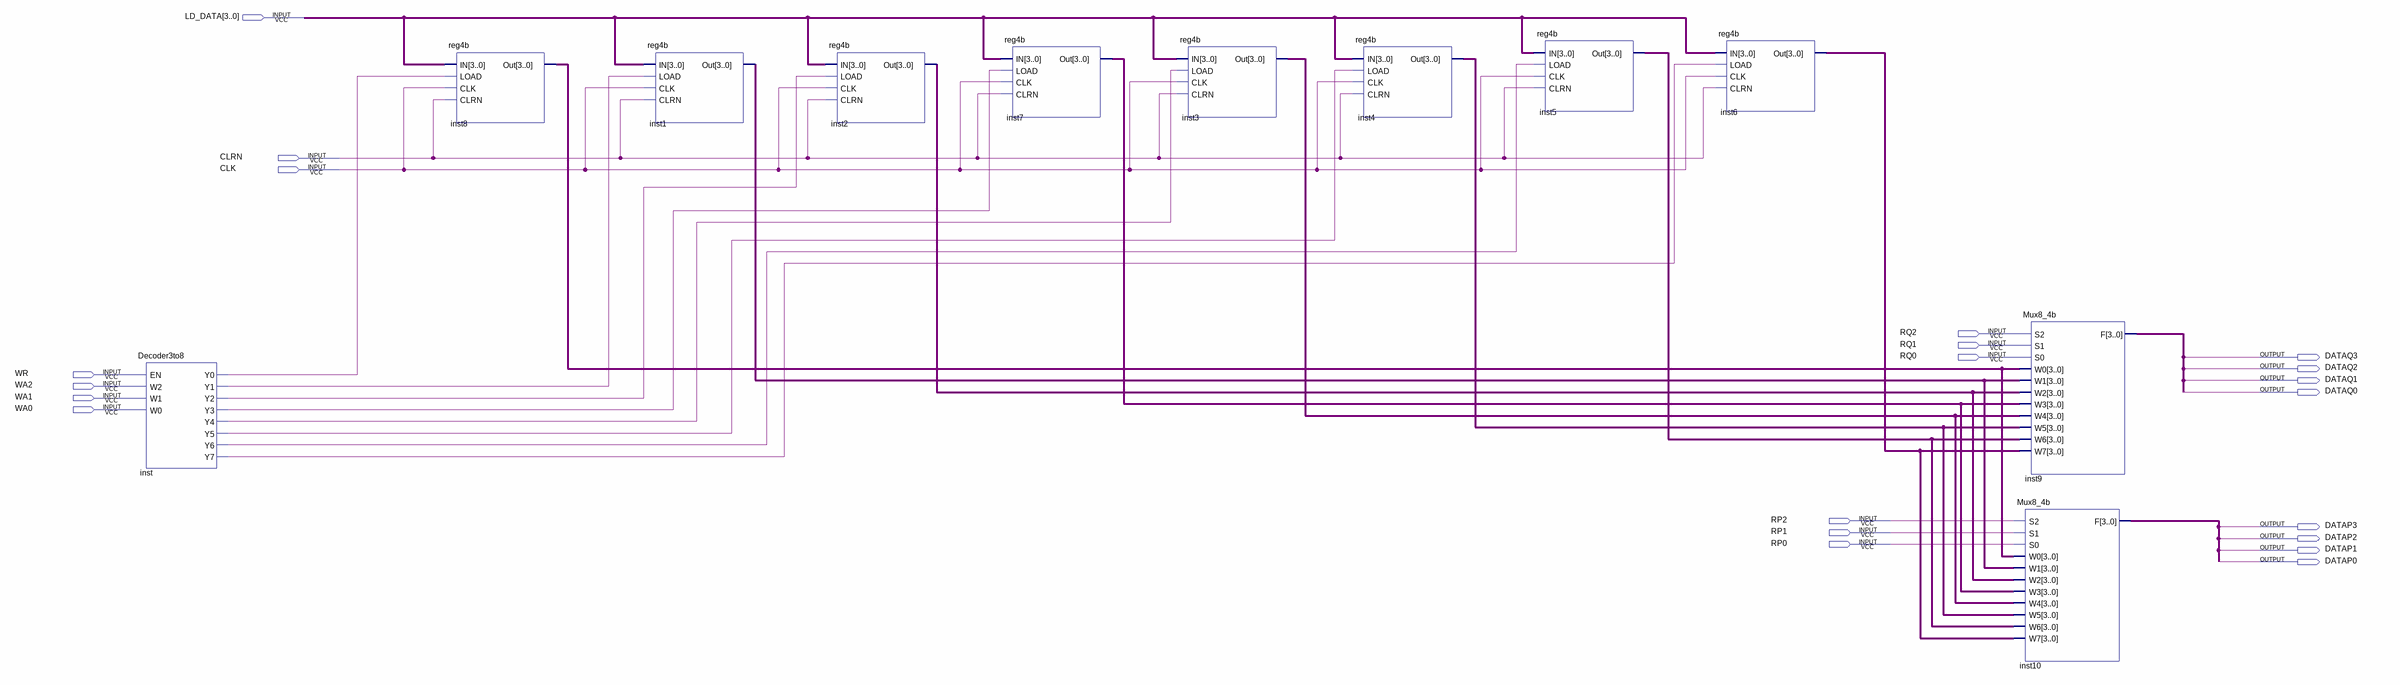
[diagram p0: schematic sheet]
// Quartus schematic regfile.bdf as structural Verilog: 11 symbols, 21 pins
module regfile (
  input  [3:0] LD_DATA,
  input  CLRN,
  input  CLK,
  input  RQ2,
  input  RQ1,
  input  RQ0,
  input  WR,
  input  WA2,
  input  WA1,
  input  WA0,
  input  RP2,
  input  RP1,
  input  RP0,
  output DATAQ3,
  output DATAQ2,
  output DATAQ1,
  output DATAQ0,
  output DATAP3,
  output DATAP2,
  output DATAP1,
  output DATAP0
);

  wire inst_y0, inst_y1, inst_y2, inst_y3, inst_y4, inst_y5, inst_y6, inst_y7;
  wire [3:0] inst1_out, inst2_out, inst3_out, inst4_out, inst5_out, inst6_out, inst7_out, inst8_out, inst9_f,
       inst10_f;

  Decoder3to8 inst (
    .EN(WR), .W2(WA2), .W1(WA1), .W0(WA0), .Y0(inst_y0), .Y1(inst_y1), .Y2(inst_y2), .Y3(inst_y3),
    .Y4(inst_y4), .Y5(inst_y5), .Y6(inst_y6), .Y7(inst_y7));
  reg4b inst8 (.IN(LD_DATA), .LOAD(inst_y0), .CLK(CLK), .CLRN(CLRN), .Out(inst8_out));
  reg4b inst1 (.IN(LD_DATA), .LOAD(inst_y1), .CLK(CLK), .CLRN(CLRN), .Out(inst1_out));
  reg4b inst2 (.IN(LD_DATA), .LOAD(inst_y2), .CLK(CLK), .CLRN(CLRN), .Out(inst2_out));
  reg4b inst7 (.IN(LD_DATA), .LOAD(inst_y3), .CLK(CLK), .CLRN(CLRN), .Out(inst7_out));
  reg4b inst3 (.IN(LD_DATA), .LOAD(inst_y4), .CLK(CLK), .CLRN(CLRN), .Out(inst3_out));
  reg4b inst4 (.IN(LD_DATA), .LOAD(inst_y5), .CLK(CLK), .CLRN(CLRN), .Out(inst4_out));
  reg4b inst5 (.IN(LD_DATA), .LOAD(inst_y6), .CLK(CLK), .CLRN(CLRN), .Out(inst5_out));
  reg4b inst6 (.IN(LD_DATA), .LOAD(inst_y7), .CLK(CLK), .CLRN(CLRN), .Out(inst6_out));
  Mux8_4b inst9 (
    .S2(RQ2), .S1(RQ1), .S0(RQ0), .W0(inst8_out), .W1(inst1_out), .W2(inst2_out), .W3(inst7_out),
    .W4(inst3_out), .W5(inst4_out), .W6(inst5_out), .W7(inst6_out), .F(inst9_f));
  Mux8_4b inst10 (
    .S2(RP2), .S1(RP1), .S0(RP0), .W0(inst8_out), .W1(inst1_out), .W2(inst2_out), .W3(inst7_out),
    .W4(inst3_out), .W5(inst4_out), .W6(inst5_out), .W7(inst6_out), .F(inst10_f));
endmodule
